# EAGLE design untitled (EAGLE 9.6.2)
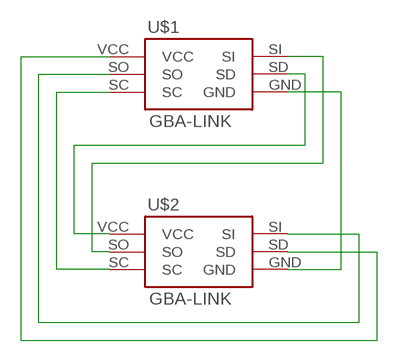
[diagram p0: schematic, sheet 1]

## Parts
U$1  GBA-LINK  [GBA-LINK]
U$2  GBA-LINK  [GBA-LINK]

## Nets
N$1: U$1.VCC U$2.SD
N$2: U$1.GND U$2.GND
N$3: U$1.SC U$2.SC
N$4: U$1.SO U$2.SI
N$5: U$1.SD U$2.VCC
N$6: U$1.SI U$2.SO
Unconnected: U$1.S$1 U$1.S$2(S$1) U$2.S$1 U$2.S$2(S$1)

## Library data of the parts
U$1 U$2 = Catskulls_link_port:GBA-LINK

## Board
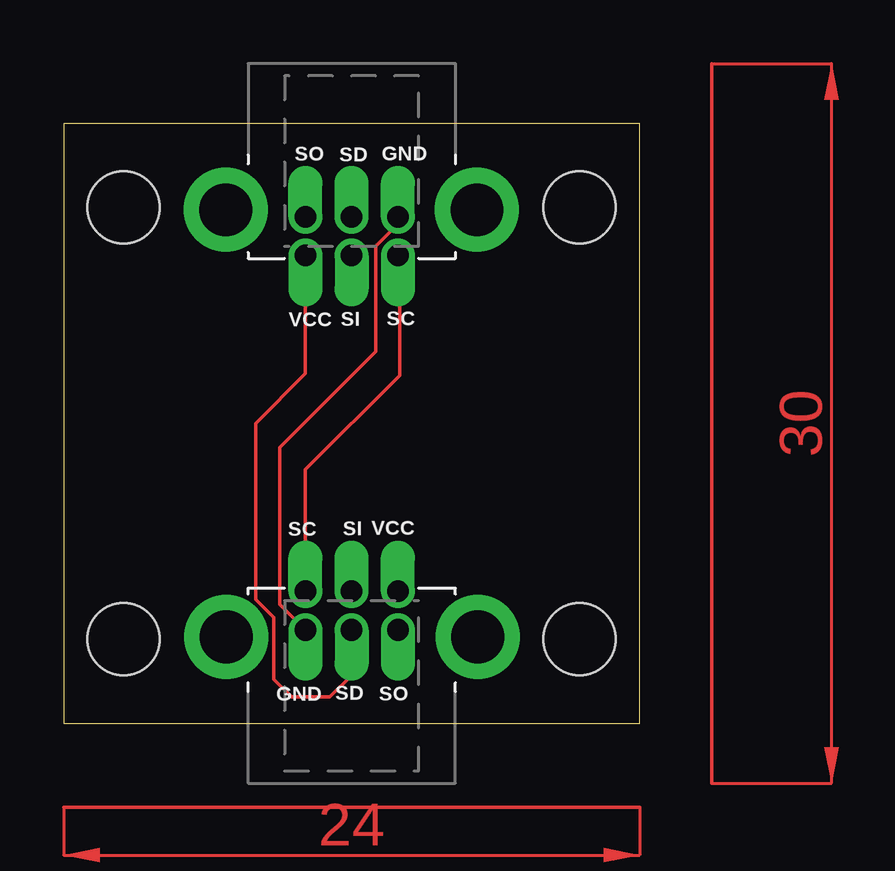
[diagram p1: board, top side]
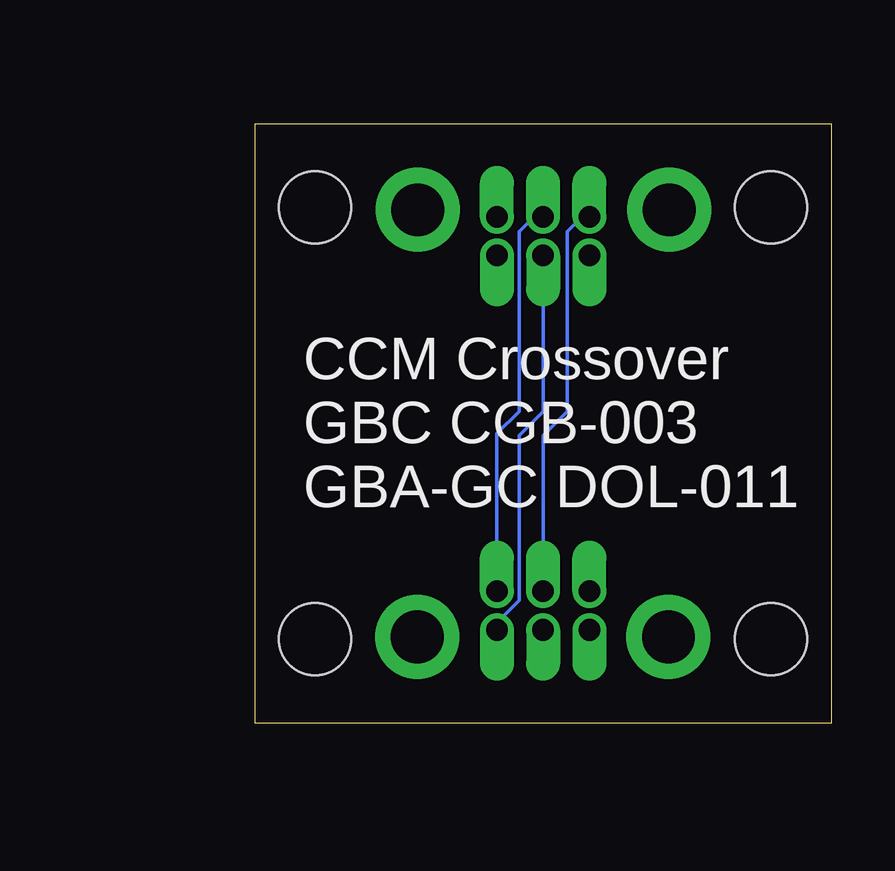
[diagram p2: board, bottom side, seen from below]

Size 24 x 25 mm. Coordinates in mm from the lower left corner, seen from the top.
Outline: 0,0 24,0 24,25 0,25 0,0
Copper layers (1*16): Top 0.035mm / dielectric 1.5mm / Bottom 0.035mm
Design rules "default": minimum track width 6mil, minimum drill 0.35mm, track to track 6mil, track to pad 6mil, pad to pad 6mil, via to via 6mil, smd to smd 6mil, copper to edge 40mil, drill to drill 6mil, minimum pad ring 10mil, minimum via ring 8mil, stop-mask expansion 4mil, vias tented up to drill 0mil, thermal gap 10mil
Holes 3 mm at 2.5,21.5 21.5,21.5 21.5,3.5 2.5,3.5

### Footprints (pad centres in the part's own frame; a part is rotated, then mirrored left to right if it is on the bottom)
GBA-LINK = drill 0.9 pad 1.27 offset: GND -1.93,-1.61; SC -1.93,0; SD 0,-1.61; SI 0,0; SO 1.93,-1.61; VCC 1.93,0 | drill 2.2 pad 3.5: S$1 -5.22,-1.905; S$2 5.25,-1.905

### Placement (x,y rotation side)
U$1  12,19.5 180 top
U$2  12,5.5 0 top

### Tracks (layer width: path | path; a pad name or v marks a point on that pad's centre or on a via)
N$1
  Top 0.152: U$2.SD 12,2 11.09,1.09 9.5,1.09 8.76,1.83 8.76,4.42 8,5.17 8,12.5 10.07,14.57 U$1.VCC
N$2
  Top 0.152: U$2.GND 9,4.96 9,11.5 13,15.5 13,17.7 13,17.71 13,19.89 13.93,20.82 U$1.GND
N$3
  Top 0.152: U$2.SC 10.07,10.57 14,14.5 14,19.43 U$1.SC
N$4
  Bottom 0.152: U$2.SI 12,12 11,13 11,17.7 11,17.71 11,19.89 11,20.5 10.39,21.11 U$1.SO
N$5
  Bottom 0.152: U$2.VCC 13.93,12.07 13,13 13,19.89 13,20.5 12.39,21.11 U$1.SD
N$6
  Bottom 0.152: U$2.SO 13.93,4.18 13,5.11 13,12 12,13 U$1.SI
N$8
  Top 0.152: 27,-2.5 27,27.5
N$9
  Top 0.152: 0,-3.5 24,-3.5
(copper drawn outside any net)
  shapes: Top area x2

### Text on the board
bPlace: CCM Crossover / GBC CGB-003 / GBA-GC DOL-011